# Altium schematic sheet High Power Output.SchDoc
size A; SheetNumber: 3; SheetTotal: 9
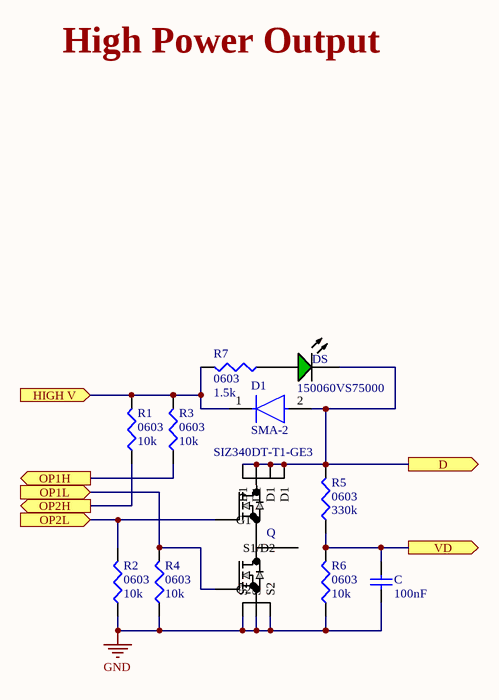
[diagram p0: High Power Output.SchDoc]

## Parts
C  100nF  [CAPC1608X95X40ML15T15]
D1  SMA-2  [FP-DO-214AC-MFG]
DS  150060VS75000  [WE-150060VS75000_V]
Q  SIZ340DT-T1-GE3  [MOSFET_DT-T1-GE3_VIS]
R1  0603  value 10k  [J1-0603]
R2  0603  value 10k  [J1-0603]
R3  0603  value 10k  [J1-0603]
R4  0603  value 10k  [J1-0603]
R5  0603  value 330k  [J1-0603]
R6  0603  value 10k  [J1-0603]
R7  0603  value 1.5k  [J1-0603]

## Ports
D (out), HIGH V (in), OP1H (out), OP1L (in), OP2H (out), OP2L (in), VD (out)

## Nets
GND: C.1 Q.5(S2) Q.6(S2) Q.7(S2) R2.1 R4.1 R6.1
D: D1.2(A) DS.1(K) Q.2(D1) Q.3(D1) Q.4(D1) Q.10(D1) R5.2 ; port D
HIGH V: D1.1(C) R1.2 R3.2 R7.2 ; port HIGH V
OP1H: R3.1 ; port OP1H
OP1L: Q.8(G2) R4.2 ; port OP1L
OP2H: R1.1 ; port OP2H
OP2L: Q.1(G1) R2.2 ; port OP2L
VD: C.2 R5.1 R6.2 ; port VD
NetDS_2: DS.2(A) R7.1

Not connected (* = marked no-connect by the designer): Q 9(S1/D2)

## Notes on the sheet
- High Power Output

## Library data of the parts
C = CMP-2006-01550-1: Manufacturer: Vitramon; Part Number: VJ0603Y104KXQCW1BC
D1 = CMP-56207-000009-1: DIODE GEN PURP 1.6KV 1A DO214AC; Reverse Recovery Time: 2.5us; Average Rectified Current: 1A; RoHS Compliant: Yes; Packaging: Cut Tape; Mount: Surface Mount; Max Reverse Voltage (DC): 1.6kV
DS = CMP-1426-00006-4: WL-SMCW SMD Chip LED Top View Monocolor Waterclear, 30 mA, 2 V, -40 to 85 degC, 2-Pin SMD, RoHS, Tape and Reel; DatasheetVersion: Rev. 2.7; PackageDescription: 2-Pin Surface Mount Device, Body 1.6 x 0.8 mm; ComponentLink1URL: https://www.we-online.com/; PartNumber: 150060VS75000; RoHSCompliant: True; ComponentLink2URL: http://katalog.we-online.de/led/datasheet/150060VS75000.pdf; ComponentLink1Description: Manufacturer URL; Mounting Technology: Surface Mount; ComponentLink2Description: Datasheet
Q = SIZ340DT-T1-GE3: No Description Available; Mfr_Name: Vishay; Copyright: Copyright (C) 2022 Ultra Librarian. All rights reserved.; Manufacturer_Part_Number: SIZ340DT-T1-GE3; RefDes: RefDes; Type: DEV
R1-R7 = Res3: Resistor; Published: 8-Jun-2000; LatestRevisionDate: 29-May-2009; LatestRevisionNote: IPC-7351 Footprint Added.; PackageReference: J1-0603; Publisher: Altium Limited; PackageDescription: Chip Resistor